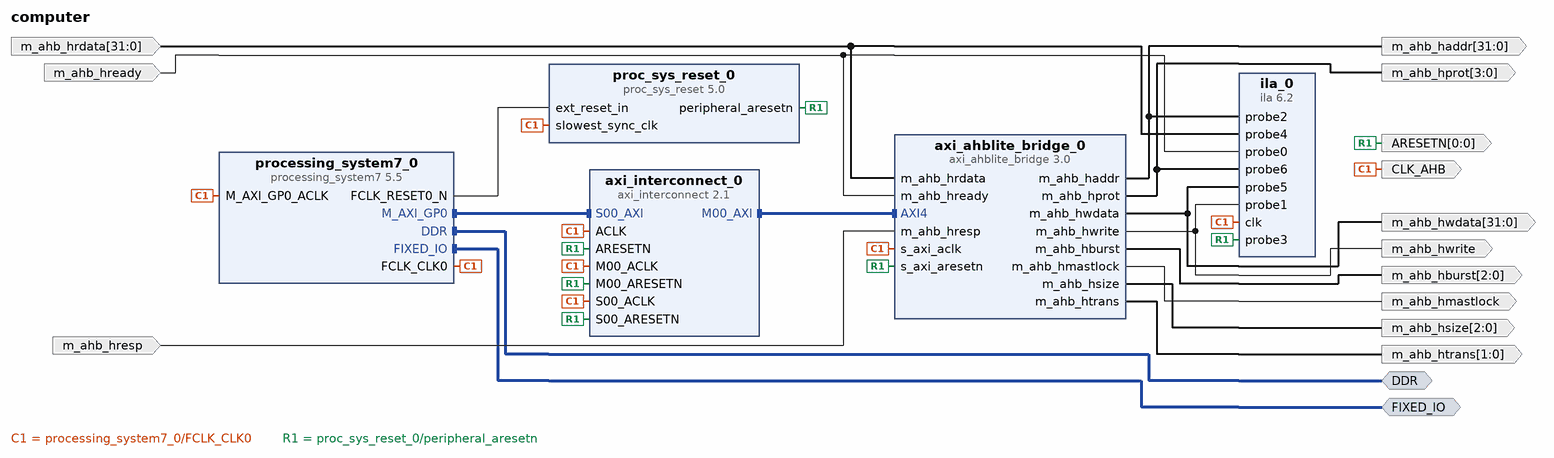
[diagram p0: block diagram of the top level]
# Vivado block design computer, xc7z020clg400-1, Vivado 2024.2
create_bd_design computer

create_bd_intf_port -mode Master -vlnv xilinx.com:interface:ddrx_rtl:1.0 DDR
create_bd_intf_port -mode Master -vlnv xilinx.com:display_processing_system7:fixedio_rtl:1.0 FIXED_IO
create_bd_port -dir O -from 0 -to 0 -type rst ARESETN
create_bd_port -dir O -type clk CLK_AHB
create_bd_port -dir O -from 31 -to 0 m_ahb_haddr
create_bd_port -dir O -from 2 -to 0 m_ahb_hburst
create_bd_port -dir O m_ahb_hmastlock
create_bd_port -dir O -from 3 -to 0 m_ahb_hprot
create_bd_port -dir I -from 31 -to 0 m_ahb_hrdata
create_bd_port -dir I m_ahb_hready
create_bd_port -dir I m_ahb_hresp
create_bd_port -dir O -from 2 -to 0 m_ahb_hsize
create_bd_port -dir O -from 1 -to 0 m_ahb_htrans
create_bd_port -dir O -from 31 -to 0 m_ahb_hwdata
create_bd_port -dir O m_ahb_hwrite

create_bd_cell -type ip -vlnv xilinx.com:ip:processing_system7:5.5 processing_system7_0
set_property -dict [list \
  CONFIG.PCW_UART1_PERIPHERAL_ENABLE 1 \
  CONFIG.PCW_UART1_UART1_IO {MIO 48 .. 49} \
  CONFIG.PCW_UART_PERIPHERAL_FREQMHZ 100 \
] [get_bd_cells processing_system7_0]
# 46 more settings of processing_system7_0 are not shown: defaults, MIO pin electricals, DDR timing, and values the tool derives
create_bd_cell -type ip -vlnv xilinx.com:ip:proc_sys_reset:5.0 proc_sys_reset_0
create_bd_cell -type ip -vlnv xilinx.com:ip:axi_ahblite_bridge:3.0 axi_ahblite_bridge_0
create_bd_cell -type ip -vlnv xilinx.com:ip:ila:6.2 ila_0
set_property -dict [list \
  CONFIG.C_ADV_TRIGGER false \
  CONFIG.C_EN_STRG_QUAL 0 \
  CONFIG.C_MONITOR_TYPE Native \
  CONFIG.C_NUM_OF_PROBES 7 \
  CONFIG.C_PROBE1_WIDTH 1 \
  CONFIG.C_PROBE2_TYPE 1 \
  CONFIG.C_PROBE2_WIDTH 32 \
  CONFIG.C_PROBE4_TYPE 1 \
  CONFIG.C_PROBE4_WIDTH 32 \
  CONFIG.C_PROBE5_TYPE 1 \
  CONFIG.C_PROBE5_WIDTH 32 \
  CONFIG.C_PROBE6_TYPE 1 \
  CONFIG.C_PROBE6_WIDTH 4 \
] [get_bd_cells ila_0]
create_bd_cell -type ip -vlnv xilinx.com:ip:axi_interconnect:2.1 axi_interconnect_0
set_property -dict {CONFIG.NUM_MI 1} [get_bd_cells axi_interconnect_0]

# ---- connections ----

connect_bd_intf_net [get_bd_intf_pins axi_interconnect_0/M00_AXI] [get_bd_intf_pins axi_ahblite_bridge_0/AXI4]
connect_bd_intf_net [get_bd_intf_ports DDR] [get_bd_intf_pins processing_system7_0/DDR]
connect_bd_intf_net [get_bd_intf_ports FIXED_IO] [get_bd_intf_pins processing_system7_0/FIXED_IO]
connect_bd_intf_net [get_bd_intf_pins processing_system7_0/M_AXI_GP0] [get_bd_intf_pins axi_interconnect_0/S00_AXI]
connect_bd_net [get_bd_pins axi_ahblite_bridge_0/m_ahb_haddr] [get_bd_ports m_ahb_haddr] [get_bd_pins ila_0/probe2]
connect_bd_net [get_bd_pins axi_ahblite_bridge_0/m_ahb_hburst] [get_bd_ports m_ahb_hburst]
connect_bd_net [get_bd_pins axi_ahblite_bridge_0/m_ahb_hmastlock] [get_bd_ports m_ahb_hmastlock]
connect_bd_net [get_bd_pins axi_ahblite_bridge_0/m_ahb_hprot] [get_bd_ports m_ahb_hprot] [get_bd_pins ila_0/probe6]
connect_bd_net [get_bd_pins axi_ahblite_bridge_0/m_ahb_hsize] [get_bd_ports m_ahb_hsize]
connect_bd_net [get_bd_pins axi_ahblite_bridge_0/m_ahb_htrans] [get_bd_ports m_ahb_htrans]
connect_bd_net [get_bd_pins axi_ahblite_bridge_0/m_ahb_hwdata] [get_bd_ports m_ahb_hwdata] [get_bd_pins ila_0/probe5]
connect_bd_net [get_bd_pins axi_ahblite_bridge_0/m_ahb_hwrite] [get_bd_ports m_ahb_hwrite] [get_bd_pins ila_0/probe1]
connect_bd_net -net clk_wiz_0_clk_out1 [get_bd_pins processing_system7_0/FCLK_CLK0] \
  [get_bd_pins processing_system7_0/M_AXI_GP0_ACLK] [get_bd_pins ila_0/clk] [get_bd_pins axi_ahblite_bridge_0/s_axi_aclk] \
  [get_bd_pins axi_interconnect_0/ACLK] [get_bd_pins axi_interconnect_0/S00_ACLK] [get_bd_pins axi_interconnect_0/M00_ACLK] \
  [get_bd_ports CLK_AHB] [get_bd_pins proc_sys_reset_0/slowest_sync_clk]
connect_bd_net -net m_ahb_hrdata_0_1 [get_bd_ports m_ahb_hrdata] [get_bd_pins axi_ahblite_bridge_0/m_ahb_hrdata] [get_bd_pins ila_0/probe4]
connect_bd_net -net m_ahb_hready_0_1 [get_bd_ports m_ahb_hready] [get_bd_pins axi_ahblite_bridge_0/m_ahb_hready] [get_bd_pins ila_0/probe0]
connect_bd_net -net m_ahb_hresp_0_1 [get_bd_ports m_ahb_hresp] [get_bd_pins axi_ahblite_bridge_0/m_ahb_hresp]
connect_bd_net [get_bd_pins proc_sys_reset_0/peripheral_aresetn] \
  [get_bd_pins ila_0/probe3] [get_bd_pins axi_interconnect_0/M00_ARESETN] [get_bd_pins axi_interconnect_0/S00_ARESETN] \
  [get_bd_pins axi_interconnect_0/ARESETN] [get_bd_pins axi_ahblite_bridge_0/s_axi_aresetn] [get_bd_ports ARESETN]
connect_bd_net [get_bd_pins processing_system7_0/FCLK_RESET0_N] [get_bd_pins proc_sys_reset_0/ext_reset_in]

validate_bd_design
save_bd_design
